# EAGLE design amiga_external_floppy_adapter_rev2_1 (EAGLE 8.3.1)
TITLE: Sanyi
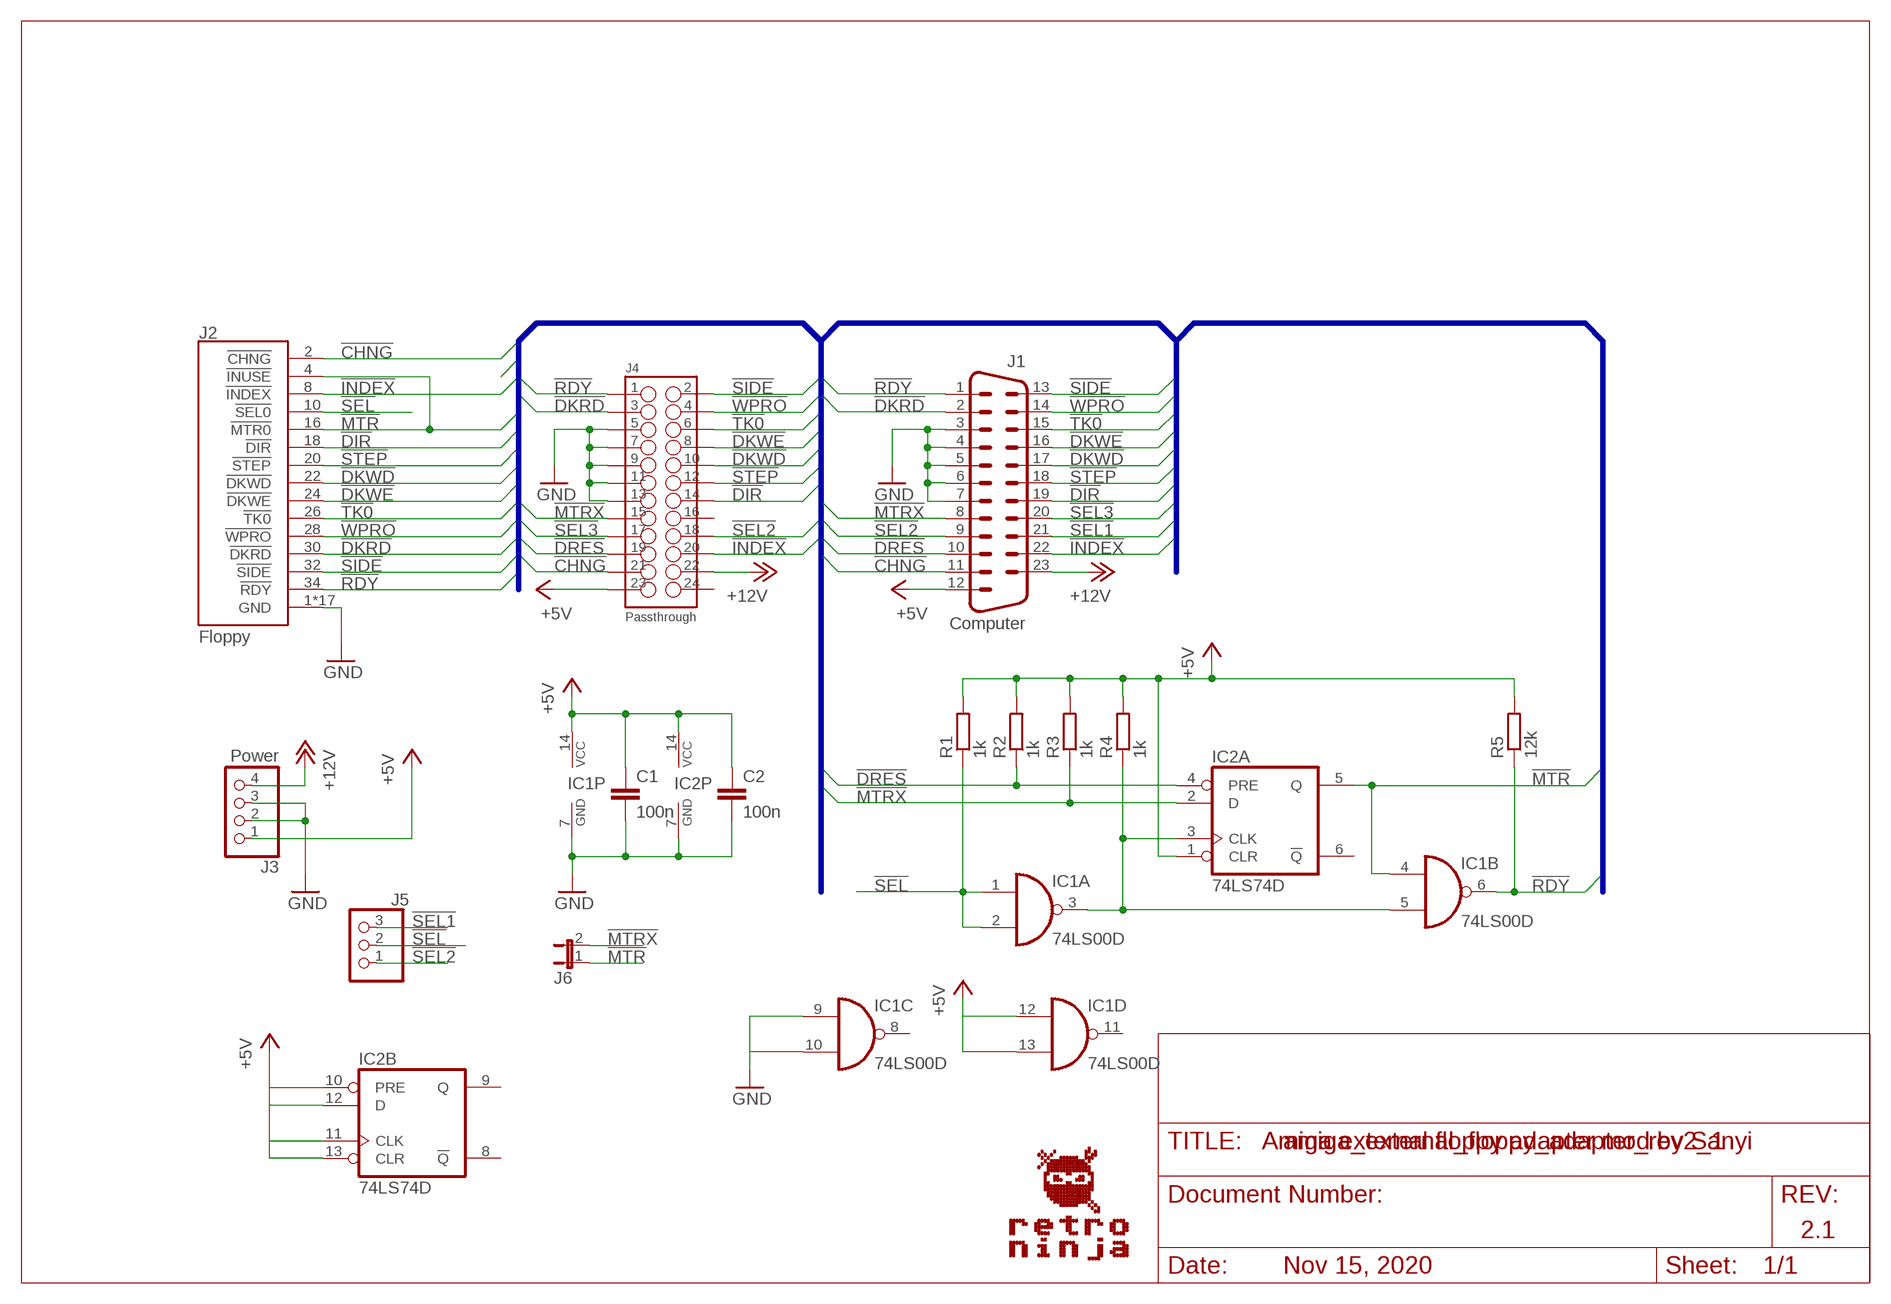
[diagram p0: schematic, sheet 1]

## Parts
C1  100n  C-EUC1206  [C1206]
C2  100n  C-EUC1206  [C1206]
IC1  74LS00D  [SO14]
IC2  74LS74D  [SO14]
J1  Computer  DSUB_M23  [DSUB_M23D]
J2  Floppy  AMIGA_FLOPPYDRV_CONNECTOR/IDC  [HEADER_2X17_WALLED]
J3  Power  PINHD-1X4  [1X04]
J4  Passthrough  HEADER_2X12/IDC  [HEADER_2X12_WALLED]
J5  PINHD-1X3  [1X03]
J6  JP1E  [JP1]
R1  1k  R-EU_R1206  [R1206]
R2  1k  R-EU_R1206  [R1206]
R3  1k  R-EU_R1206  [R1206]
R4  1k  R-EU_R1206  [R1206]
R5  12k  R-EU_R1206  [R1206]

## Nets
!CHNG: J1.11 J2.2(!CHNG) J4.21
!DIR: J1.19 J2.18(!DIR) J4.14
!DKRD: J1.2 J2.30(!DKRD) J4.3
!DKWD: J1.17 J2.22(!DKWD) J4.10
!DKWE: J1.16 J2.24(!DKWE) J4.8
!DRES: IC2.4(A:PRE) J1.10 J4.19 R2.1
!INDEX: J1.22 J2.8(!INDEX) J4.20
!MTR: IC1.4(B:I0) IC2.5(A:Q) J2.4(!INUSE) J2.16(!MTR0) J6.1
!MTRX: IC2.2(A:D) J1.8 J4.15 J6.2 R3.1
!RDY: IC1.6(B:O) J1.1 J2.34(!RDY) J4.1 R5.1
!SEL: IC1.1(A:I0) IC1.2(A:I1) J2.10(!SEL0) J5.2 R1.1
!SEL1: J1.21 J5.3
!SEL2: J1.9 J4.18 J5.1
!SEL3: J1.20 J4.17
!SIDE: J1.13 J2.32(!SIDE) J4.2
!STEP: J1.18 J2.20(!STEP) J4.12
!TK0: J1.15 J2.26(!TK0) J4.6
!WPRO: J1.14 J2.28(!WPRO) J4.4
+5V [power]: C1.1 C2.1 IC1.12(D:I0) IC1.13(D:I1) IC1.14(P:VCC) IC2.1(A:CLR) IC2.10(B:PRE) IC2.11(B:CLK) IC2.12(B:D) IC2.13(B:CLR) IC2.14(P:VCC) J1.12 J3.1 J4.23 R1.2 R2.2 R3.2 R4.2 R5.2
+12V [power]: J1.23 J3.4 J4.22
GND [power]: C1.2 C2.2 IC1.7(P:GND) IC1.9(C:I0) IC1.10(C:I1) IC2.7(P:GND) J1.3 J1.4 J1.5 J1.6 J1.7 J2.1(GND) J2.3(GND) J2.5(GND) J2.7(GND) J2.9(GND) J2.11(GND) J2.13(GND) J2.15(GND) J2.17(GND) J2.19(GND) J2.21(GND) J2.23(GND) J2.25(GND) J2.27(GND) J2.29(GND) J2.31(GND) J2.33(GND) J3.2 J3.3 J4.5 J4.7 J4.9 J4.11 J4.13
N$1: IC1.3(A:O) IC1.5(B:I1) IC2.3(A:CLK) R4.1
Unconnected: IC1.8(C:O) IC1.11(D:O) IC2.6(A:!Q) IC2.8(B:!Q) IC2.9(B:Q) J4.16 J4.24

## Buses
DATA:!CHNG,!DIR,!DKRD,!DKWD,!DKWE,!DRES,!INDEX,!INUSE,!MTR,!MTRX,!RDY,!SEL1,!SEL2,!SEL3,!SIDE,!STEP,!TK0,!WPRO

## Notes on the sheet
- Amiga external floppy adapter mod by Sanyi
- 2.1
- Nov 15, 2020

## Library data of the parts
C1 C2 = rcl:C-EU: CAPACITOR, European symbol
IC1 = 74xx-eu:74*00: Quad 2-input NAND gate
IC2 = 74xx-eu:74*74: Dual D type positive edge triggered FLIP FLOP, preset and clear
J1 = Per (Fusion 360):DSUB_M23
J2 = Per (Fusion 360):AMIGA_FLOPPYDRV_CONNECTOR
J3 = Connector:PINHD-1X4: PIN HEADER; CATEGORY: CONNECTOR; SUB-CATEGORY: PIN-HEADER
J4 = Per (Fusion 360):HEADER_2X12
J5 = pinhead:PINHD-1X3: PIN HEADER
J6 = jumper:JP1E: JUMPER
R1-R5 = rcl:R-EU_: RESISTOR, European symbol

## Net classes
0 default: width 0.254 mm
1 power: width 0.508 mm, clearance 0.508 mm

## Board
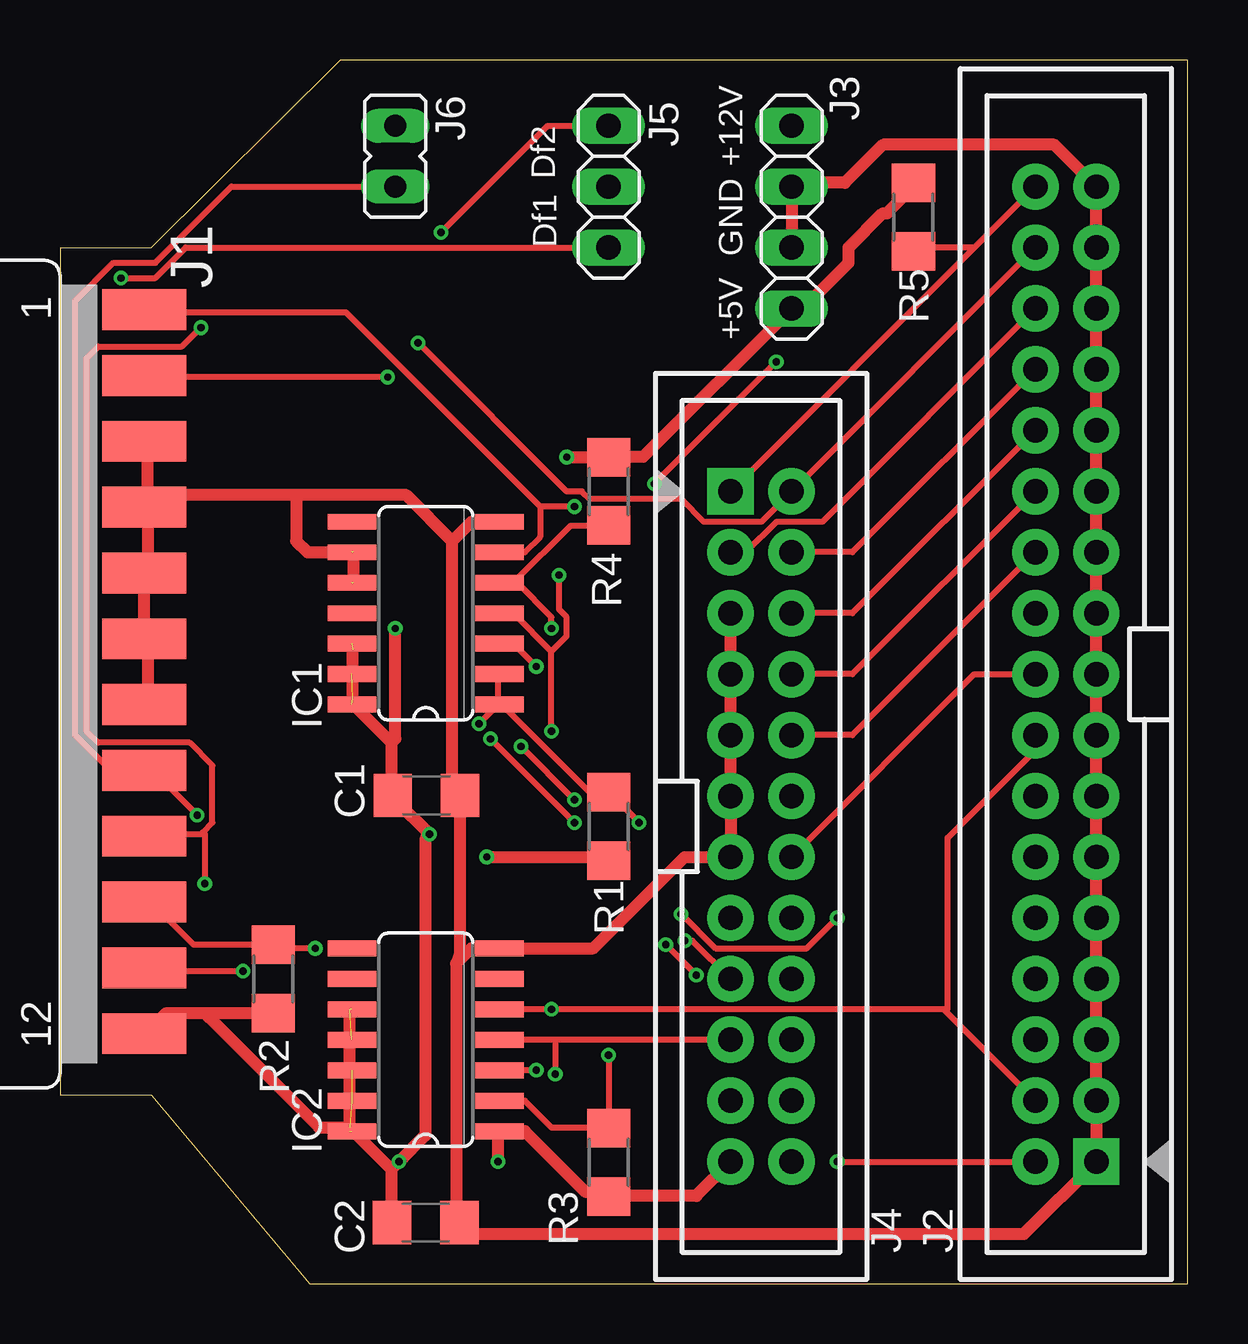
[diagram p1: board, top side]
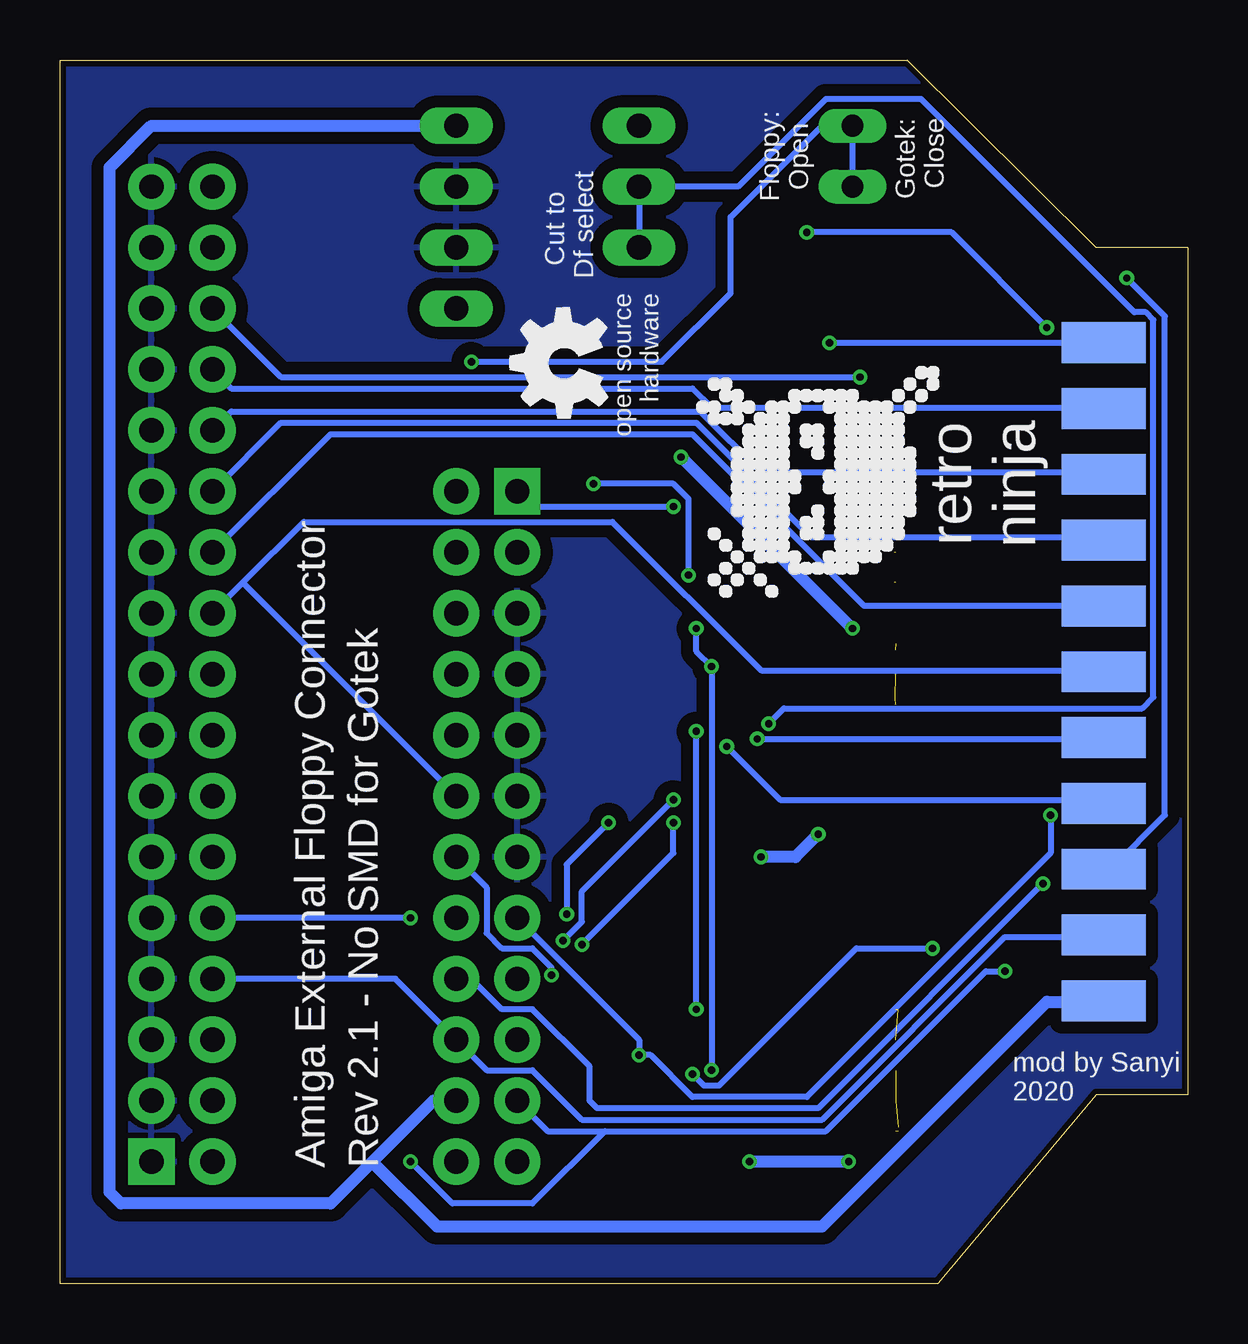
[diagram p2: board, bottom side, seen from below]

Size 46.99 x 51 mm. Coordinates in mm from the lower left corner, seen from the top.
Outline: 10.41,0 46.99,0 46.99,51 11.68,51 3.81,43.18 0,43.18 0,7.87 3.81,7.87 10.41,0
Copper layers (1*16): Top 0.035mm / dielectric 1.5mm / Bottom 0.035mm
Design rules "SeeedStudio_2layer_DRU_no_angle_20140221": minimum track width 6mil, minimum drill 12mil, track to track 6mil, track to pad 6mil, pad to pad 6mil, via to via 6mil, smd to smd 0mil, copper to edge 10mil, drill to drill 10mil, minimum pad ring 10mil, minimum via ring 6mil, stop-mask expansion 2mil, vias tented up to drill 100mil, thermal gap 10mil

### Footprints (pad centres in the part's own frame; a part is rotated, then mirrored left to right if it is on the bottom)
C1206 = smd 1.6 x 1.8: 1 -1.4,0; 2 1.4,0
SO14 = smd 0.66 x 2.032: 1 -3.81,-3.073; 2 -2.54,-3.073; 3 -1.27,-3.073; 4 0,-3.073; 5 1.27,-3.073; 6 2.54,-3.073; 7 3.81,-3.073; 8 3.81,3.073; 9 2.54,3.073; 10 1.27,3.073; 11 0,3.073; 12 -1.27,3.073; 13 -2.54,3.073; 14 -3.81,3.073
DSUB_M23D = smd 1.7 x 3.5: 1 17.729,-12.395; 2 14.986,-12.395; 3 12.243,-12.395; 4 9.5,-12.395; 5 6.756,-12.395; 6 4.013,-12.395; 7 1.27,-12.395; 8 -1.473,-12.395; 9 -4.216,-12.395; 10 -6.96,-12.395; 11 -9.703,-12.395; 12 -12.446,-12.395 | smd 1.7 x 3.5 bottom: 13 16.358,-12.395; 14 13.614,-12.395; 15 10.871,-12.395; 16 8.128,-12.395; 17 5.385,-12.395; 18 2.642,-12.395; 19 -0.102,-12.395; 20 -2.845,-12.395; 21 -5.588,-12.395; 22 -8.331,-12.395; 23 -11.074,-12.395
HEADER_2X17_WALLED = drill 1.016 pad 1.93 square: 1 -5.08,-1.27 | drill 1.016 pad 1.93: 2 -5.08,1.27; 3 -2.54,-1.27; 4 -2.54,1.27; 5 0,-1.27; 6 0,1.27; 7 2.54,-1.27; 8 2.54,1.27; 9 5.08,-1.27; 10 5.08,1.27; 11 7.62,-1.27; 12 7.62,1.27; 13 10.16,-1.27; 14 10.16,1.27; 15 12.7,-1.27; 16 12.7,1.27; 17 15.24,-1.27; 18 15.24,1.27; 19 17.78,-1.27; 20 17.78,1.27; 21 20.32,-1.27; 22 20.32,1.27; 23 22.86,-1.27; 24 22.86,1.27; 25 25.4,-1.27; 26 25.4,1.27; 27 27.94,-1.27; 28 27.94,1.27; 29 30.48,-1.27; 30 30.48,1.27; 31 33.02,-1.27; 32 33.02,1.27; 33 35.56,-1.27; 34 35.56,1.27
1X04 = drill 1.016 long: 1 -3.81,0; 2 -1.27,0; 3 1.27,0; 4 3.81,0
HEADER_2X12_WALLED = drill 1.016 pad 1.93 square: 1 -13.97,-1.27 | drill 1.016 pad 1.93: 2 -13.97,1.27; 3 -11.43,-1.27; 4 -11.43,1.27; 5 -8.89,-1.27; 6 -8.89,1.27; 7 -6.35,-1.27; 8 -6.35,1.27; 9 -3.81,-1.27; 10 -3.81,1.27; 11 -1.27,-1.27; 12 -1.27,1.27; 13 1.27,-1.27; 14 1.27,1.27; 15 3.81,-1.27; 16 3.81,1.27; 17 6.35,-1.27; 18 6.35,1.27; 19 8.89,-1.27; 20 8.89,1.27; 21 11.43,-1.27; 22 11.43,1.27; 23 13.97,-1.27; 24 13.97,1.27
1X03 = drill 1.016 long: 1 -2.54,0; 2 0,0; 3 2.54,0
JP1 = drill 0.914 long: 1 0,-1.27; 2 0,1.27
R1206 = smd 1.6 x 1.803: 1 -1.422,0; 2 1.422,0

### Placement (x,y rotation side)
C1  15.27,20.35 0 top
C2  15.24,2.54 0 top
IC1  15.24,27.94 90 top
IC2  15.24,10.16 90 top
J1  -8.89,22.86 90 top
J2  41.91,10.16 90 top
J3  30.48,44.45 90 top
J4  29.21,19.05 270 top
J5  22.86,45.72 270 top
J6  13.97,46.99 180 top
R1  22.86,19.05 270 top
R2  8.89,12.7 270 top
R3  22.86,5.05 270 top
R4  22.86,33.02 90 top
R5  35.56,44.45 90 top
U$1  [RETRONINJA_NOTEXT_10MM]  10.41,28.65 90 bottom
U$2  [OSHW_5MM]  25.98,38.37 90 bottom

### Tracks (layer width: path | path; a pad name or v marks a point on that pad's centre or on a via)
!CHNG  (via drill 0.3)
  Top 0.254: v7.62,13.02 3.65,13.02 J1.11 | v32.38,5.08 J2.2
  Bottom 0.254: v7.62,13.02 8.41,13.02 15.08,6.35 24.29,6.35 | 24.29,6.35 26.67,6.35 J4.21 | v32.38,5.08 30.64,3.33 27.3,3.33 24.29,6.35
!DIR  (via drill 0.3)
  Top 0.254: v21.43,19.21 v17.94,22.7 | v26.51,12.86 v25.24,14.13 | J2.18 38.1,25.4 J4.14
  Bottom 0.254: v17.94,22.7 3.65,22.7 J1.19 | v21.43,19.21 21.43,17.94 v25.24,14.13 | v26.51,12.86 26.51,13.18 27.3,13.97 28.57,13.97 29.21,14.61 29.21,16.51 J4.14
!DKRD  (via drill 0.3)
  Top 0.254: v13.65,37.78 3.65,37.78 J1.2 | J4.3 28.57,30.48 29.84,31.75 31.75,31.75 J2.30
  Bottom 0.254: v13.65,37.78 37.78,37.78 J2.30
!DKWD
  Top 0.254: J4.10 33.02,22.86 J2.22
  Bottom 0.254: J2.22 35.72,35.4 20.64,35.4 13.49,28.26 3.65,28.26 J1.17
!DKWE
  Top 0.254: J4.8 33.02,25.4 J2.24
  Bottom 0.254: J2.24 37.78,35.88 20.48,35.88 15.72,31.11 3.65,31.11 J1.16
!DRES  (via drill 0.3)
  Top 0.254: J1.10 3.65,16.03 5.56,14.13 R2.1 8.89,13.97 v10.64,13.97 | J4.19 20.64,10.16 | 20.64,10.16 IC2.4 | 20.64,10.16 v20.64,8.73
  Bottom 0.254: v10.64,13.97 13.81,13.97 19.53,8.26 20.16,8.26 v20.64,8.73
!INDEX
  Bottom 0.254: J1.22 3.65,14.45 7.62,14.45 15.24,6.83 25.24,6.83 27.3,8.89 29.21,8.89 J4.20 33.02,12.7 J2.8
!MTR  (via drill 0.3)
  Top 0.254: IC2.5 v20.48,11.43 36.83,11.43 36.91,11.35 | J2.4 36.91,11.35 | IC1.4 18.89,27.94 20.48,26.35 | v20.48,23.02 20.48,26.35 | v24.77,33.34 v29.84,38.42 | v20.8,29.53 20.8,28.1 21.11,27.78 21.11,26.99 20.48,26.35 | J2.16 40.64,22.23 36.99,18.57 36.99,11.43 36.91,11.35
  Bottom 0.254: v20.48,11.43 v20.48,23.02 | v29.84,38.42 21.91,38.42 19.05,41.27 19.05,44.45 15.24,48.26 J6.1 13.97,46.04 | v24.77,33.34 21.43,33.34 20.8,32.7 v20.8,29.53
!MTRX  (via drill 0.3)
  Top 0.254: 22.86,6.51 20.48,6.51 19.37,7.62 IC2.2 | v22.86,9.53 22.86,6.51 | 22.86,6.51 R3.1 | J6.2 7.14,45.72 3.97,42.55 2.22,42.55 0.64,40.96 0.64,22.86 2.06,21.43 3.49,21.43 J1.8 3.65,21.27 3.97,21.27 v5.71,19.53
  Bottom 0.254: J4.15 22.86,10.16 v22.86,9.53 22.38,9.53 20.64,7.78 15.88,7.78 5.71,17.94 v5.71,19.53
!RDY  (via drill 0.3)
  Top 0.254: IC1.6 19.37,30.48 20,31.11 20,32.38 | 20,32.38 11.91,40.48 3.65,40.48 J1.1 | 38.1,43.18 35.56,43.18 R5.1 | J2.34 38.1,43.18 | 38.1,43.18 J4.1 | v21.43,32.38 20,32.38
  Bottom 0.254: v21.43,32.38 27.3,32.38 J4.1
!SEL  (via drill 0.3)
  Top 0.254: R1.1 22.07,20.48 18.41,24.13 IC1.1 18.26,24.13 | 18.26,24.13 18.26,25.4 IC1.2 | 18.26,24.13 v17.46,23.34 | v32.38,15.24 31.11,13.97 27.3,13.97 v25.88,15.4 | R1.1 v24.13,19.21 | R1.1
  Bottom 0.254: v17.46,23.34 16.83,23.97 1.91,23.97 1.43,24.45 1.43,40.16 1.75,40.48 2.22,40.48 11.11,49.37 15.08,49.37 18.73,45.72 J5.2 22.86,43.5 | v32.38,15.24 J2.10 | v25.88,15.4 25.88,17.46 v24.13,19.21
!SEL1  (via drill 0.3)
  Top 0.254: J5.3 5.24,43.18 3.97,41.91 v2.54,41.91
  Bottom 0.254: v2.54,41.91 0.95,40.32 0.95,19.53 3.17,17.3 3.49,17.3 J1.21
!SEL2  (via drill 0.3)
  Top 0.254: v15.88,43.81 20.32,48.26 J5.1 | v5.87,39.85 5.08,39.05 1.59,39.05 1.11,38.58 1.11,23.02 1.59,22.54 5.4,22.54 6.35,21.59 6.35,19.21 5.95,18.81 | 5.95,18.81 5.87,18.73 3.65,18.73 J1.9 | v6.03,16.67 6.03,18.73 5.95,18.81
  Bottom 0.254: v15.88,43.81 9.84,43.81 v5.87,39.85 | J4.18 29.84,12.7 28.57,11.43 27.3,11.43 24.92,9.05 24.92,7.62 24.61,7.3 15.4,7.3 v6.03,16.67
!SEL3  (via drill 0.3)
  Top 0.254: v21.43,20.16 v19.21,22.38 | v26.04,14.29 26.35,14.29 J4.17
  Bottom 0.254: v19.21,22.38 16.99,20.16 3.65,20.16 J1.20 | v21.43,20.16 25.24,16.35 25.24,15.08 v26.04,14.29
!SIDE  (via drill 0.3)
  Top 0.254: v14.92,39.21 21.11,33.02 21.75,33.02 22.07,32.7 25.88,32.7 26.83,31.75 29.21,31.75 J4.2 J2.32
  Bottom 0.254: v14.92,39.21 3.65,39.21 J1.13
!STEP
  Bottom 0.254: J2.20 39.37,29.21 | 39.37,29.21 36.83,31.75 23.97,31.75 17.78,25.56 3.65,25.56 J1.18 | 39.37,29.21 J4.12
!TK0
  Top 0.254: J4.6 33.02,27.94 J2.26
  Bottom 0.254: J2.26 39.85,36.35 20.32,36.35 17.78,33.81 3.65,33.81 J1.15
!WPRO
  Top 0.254: J4.4 33.02,30.48 J2.28
  Bottom 0.254: J2.28 39.85,37.31 20.64,37.31 19.84,36.51 3.65,36.51 J1.14
+5V  (via drill 0.3)  (8 unrouted)
  Top 0.508: R5.2 35.56,45.72 34.45,44.61 34.29,44.61 32.86,43.18 32.86,42.55 31.11,40.8 30.64,40.8 J3.1 24.29,34.45 R4.2 22.7,34.45 v21.11,34.45 | 13.81,22.54 13.81,20.48 C1.1 13.97,20.16 v15.4,18.73 15.24,18.57 15.24,6.19 v14.13,5.08 13.81,4.76 | 13.81,22.54 12.22,24.13 IC1.14 | v17.78,17.78 22.86,17.78 R1.2 | J4.23 26.51,3.65 22.86,3.65 R3.2 22.7,3.81 21.91,3.81 19.37,6.35 IC2.1 18.26,6.19 v18.26,5.08 | 13.81,4.76 13.81,2.54 C2.1 | 13.81,4.76 12.22,6.35 IC2.14 12.06,6.51 10.79,6.51 6.19,11.11 6.19,11.27 | 6.19,11.27 4.45,11.27 3.65,10.48 J1.12 | 6.19,11.27 R2.2 | v13.97,27.3 13.97,22.7 13.81,22.54 | 12.19,24.38 12.19,26.42 | 12.06,6.35 12.06,11.43
  Bottom 0.508: v17.78,17.78 16.35,17.78 v15.4,18.73 | v14.13,5.08 v18.26,5.08 | v13.97,27.3 v21.11,34.45
+12V
  Bottom 0.508: J3.4 43.18,48.26 44.93,46.51 44.93,3.81 44.45,3.33 35.72,3.33 33.97,5.08 | 33.97,5.08 31.43,7.62 J4.22 | 33.97,5.08 31.27,2.38 15.24,2.38 5.87,11.75 3.65,11.75 J1.23
GND  (2 unrouted)
  Top 0.508: J3.2 J3.3 30.64,45.88 32.7,45.88 34.29,47.47 41.43,47.47 J2.33 J2.31 J2.29 J2.27 J2.25 J2.23 J2.21 J2.19 J2.17 J2.15 J2.13 J2.11 J2.9 J2.7 J2.5 J2.3 J2.1 40.16,2.06 17.14,2.06 16.83,2.38 C2.2 16.51,2.54 16.51,13.34 | J4.5 J4.7 J4.9 J4.11 J4.13 26.04,17.78 22.23,13.97 IC2.7 17.14,13.97 16.51,13.34 | J1.4 3.65,32.23 3.65,29.69 J1.5 3.49,29.37 3.49,26.99 J1.6 3.65,26.67 3.65,24.13 J1.7 | J1.3 3.65,35.08 3.65,32.54 J1.4 | 16.51,13.34 16.67,13.81 16.67,20.32 C1.2 16.51,20.48 16.35,20.64 16.35,30.96 | IC1.7 17.14,31.75 16.35,30.96 | 9.84,32.86 14.45,32.86 16.35,30.96 | 9.84,32.86 3.81,32.86 J1.4 | 9.84,32.86 9.84,30.96 10.32,30.48 12.22,30.48 12.22,29.21
  pour Bottom: -0.64,51.44 47.62,51.44 48.26,50.8 48.26,0.64 46.99,-0.64 -1.27,-0.64 -1.27,50.8
N$1  (via drill 0.3)
  Top 0.254: R4.1 21.27,31.59 18.89,29.21 IC1.5 19.05,29.21 20.48,27.78 v20.48,27.3 | v19.84,8.89 IC2.3 | v19.84,25.72 18.89,26.67 IC1.3
  Bottom 0.254: v19.84,8.89 v19.84,25.72 20.48,26.35 v20.48,27.3

### Text on the board
tPlace: +12V | Df2 | Df1 | GND | +5V
bPlace: Gotek: / Close | Floppy: / Open | Cut to / Df select | retro / ninja | mod by Sanyi / 2020 | Rev 2.1 - No SMD for Gotek | Amiga External Floppy Connector